# Altium schematic sheet Schema_bloc.SchDoc
size A3; Organization: ETML-ES; Address1: Avenue Recordon 1; Address2: 1004 Lausanne; Address3: Switzerland; SheetNumber: 1; SheetTotal: 6
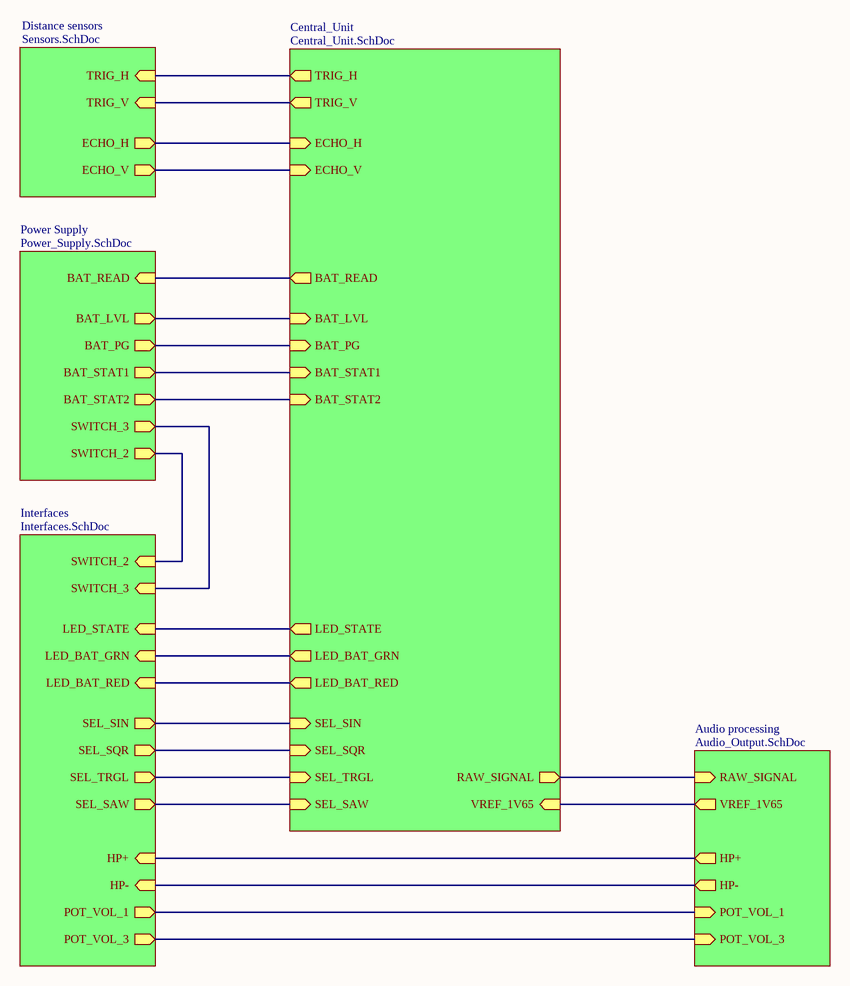
[diagram p0: Schema_bloc.SchDoc]

## Sub-sheets
Audio processing = Audio_Output.SchDoc: POT_VOL_3 (in), POT_VOL_1 (in), RAW_SIGNAL (in), VREF_1V65 (out), HP+ (out), HP- (out)
Central_Unit = Central_Unit.SchDoc: RAW_SIGNAL (out), VREF_1V65 (in), SEL_SIN (in), SEL_SQR (in), SEL_TRGL (in), SEL_SAW (in), LED_STATE (out), LED_BAT_GRN (out), LED_BAT_RED (out), TRIG_H (out), TRIG_V (out), ECHO_H (in), ECHO_V (in), BAT_READ (out), BAT_LVL (in), BAT_PG (in), BAT_STAT1 (in), BAT_STAT2 (in)
Distance sensors = Sensors.SchDoc: ECHO_V (out), ECHO_H (out), TRIG_V (in), TRIG_H (in)
Interfaces = Interfaces.SchDoc: POT_VOL_1 (out), POT_VOL_3 (out), SWITCH_2 (in), SWITCH_3 (in), SEL_SIN (out), SEL_SQR (out), SEL_TRGL (out), SEL_SAW (out), LED_STATE (in), LED_BAT_RED (in), LED_BAT_GRN (in), HP- (in), HP+ (in)
Power Supply = Power_Supply.SchDoc: BAT_LVL (out), BAT_READ (in), BAT_PG (out), BAT_STAT2 (out), BAT_STAT1 (out), SWITCH_2 (out), SWITCH_3 (out)

## Nets
(unnamed): sheet Distance sensors/ECHO_V, sheet Central_Unit/ECHO_V
(unnamed): sheet Distance sensors/ECHO_H, sheet Central_Unit/ECHO_H
(unnamed): sheet Distance sensors/TRIG_V, sheet Central_Unit/TRIG_V
(unnamed): sheet Distance sensors/TRIG_H, sheet Central_Unit/TRIG_H
(unnamed): sheet Audio processing/POT_VOL_3, sheet Interfaces/POT_VOL_3
(unnamed): sheet Audio processing/POT_VOL_1, sheet Interfaces/POT_VOL_1
(unnamed): sheet Audio processing/RAW_SIGNAL, sheet Central_Unit/RAW_SIGNAL
(unnamed): sheet Audio processing/VREF_1V65, sheet Central_Unit/VREF_1V65
(unnamed): sheet Audio processing/HP+, sheet Interfaces/HP+
(unnamed): sheet Audio processing/HP-, sheet Interfaces/HP-
(unnamed): sheet Power Supply/BAT_LVL, sheet Central_Unit/BAT_LVL
(unnamed): sheet Power Supply/BAT_READ, sheet Central_Unit/BAT_READ
(unnamed): sheet Power Supply/BAT_PG, sheet Central_Unit/BAT_PG
(unnamed): sheet Power Supply/BAT_STAT2, sheet Central_Unit/BAT_STAT2
(unnamed): sheet Power Supply/BAT_STAT1, sheet Central_Unit/BAT_STAT1
(unnamed): sheet Power Supply/SWITCH_2, sheet Interfaces/SWITCH_2
(unnamed): sheet Power Supply/SWITCH_3, sheet Interfaces/SWITCH_3
(unnamed): sheet Interfaces/SEL_SIN, sheet Central_Unit/SEL_SIN
(unnamed): sheet Interfaces/SEL_SQR, sheet Central_Unit/SEL_SQR
(unnamed): sheet Interfaces/SEL_TRGL, sheet Central_Unit/SEL_TRGL
(unnamed): sheet Interfaces/SEL_SAW, sheet Central_Unit/SEL_SAW
(unnamed): sheet Interfaces/LED_STATE, sheet Central_Unit/LED_STATE
(unnamed): sheet Interfaces/LED_BAT_RED, sheet Central_Unit/LED_BAT_RED
(unnamed): sheet Interfaces/LED_BAT_GRN, sheet Central_Unit/LED_BAT_GRN

## Notes on the sheet
- Fichier :
- a
- Date :
- Heure :
- Version :
- Auteur :
- Modif.
- b
- c
- d
- Projet :
- No :
- Nb feuilles
- Feuille n°
- Chemin :